# Altium project Main.PrjPCB
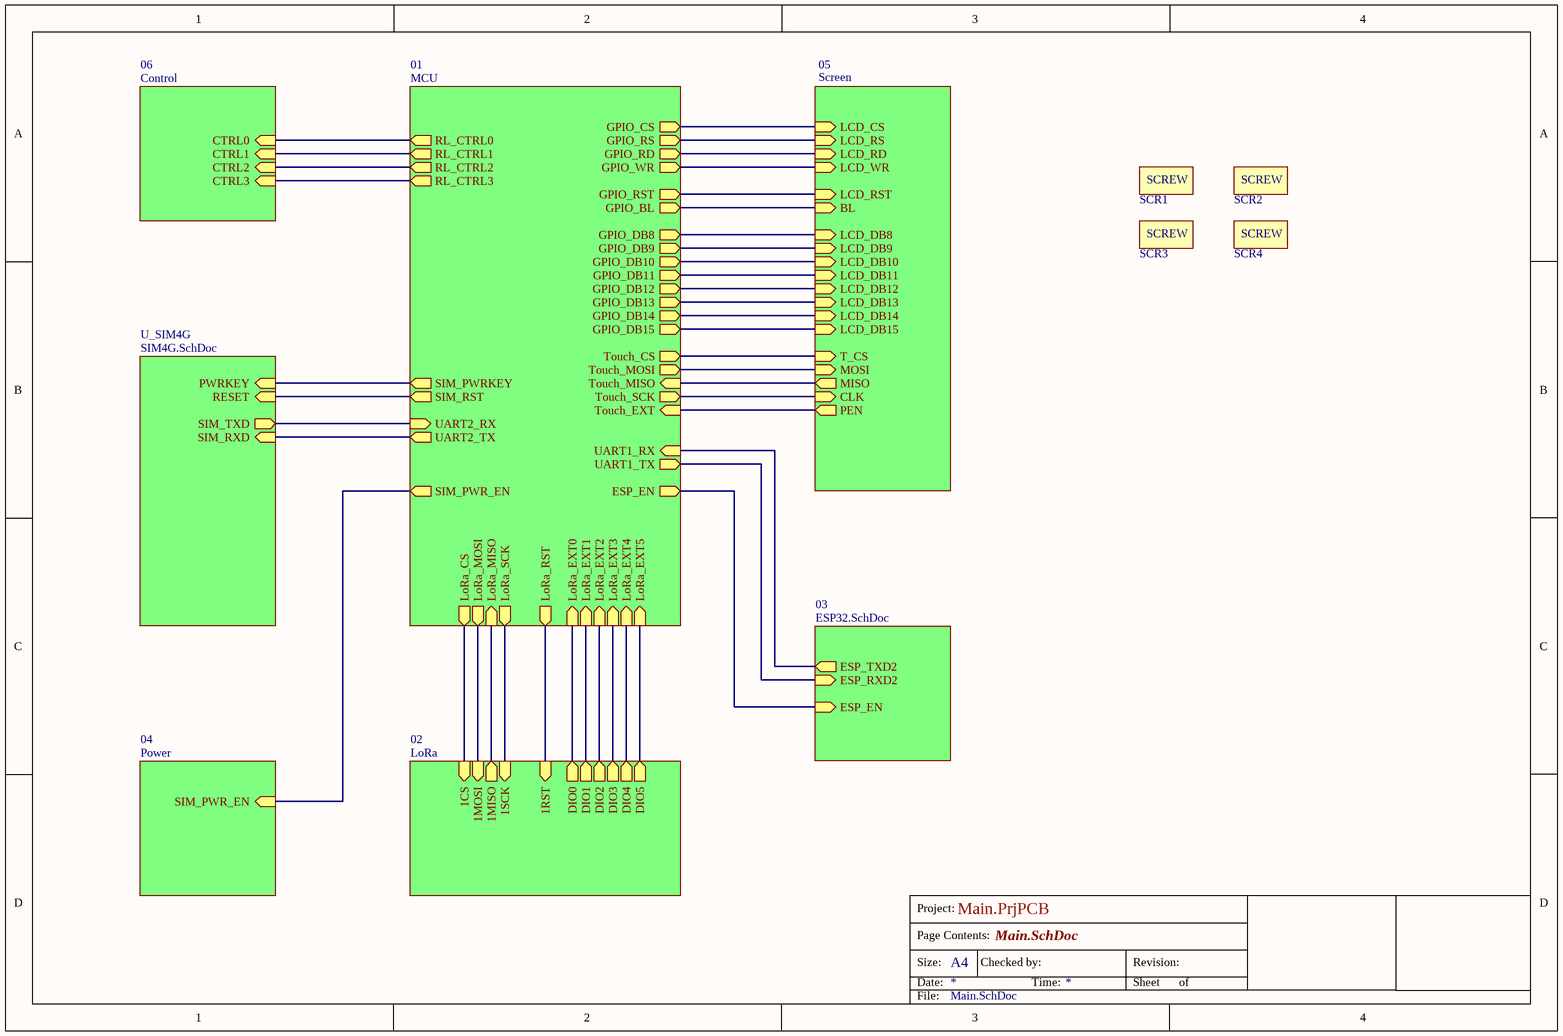
[diagram p0: Main.SchDoc]
8 sheets, 174 parts. Net scope: hierarchical (ports join the sheet entries above them; power ports are global).
Board file: Gateway_V2.PcbDoc
Sheets:
  Main.SchDoc
    01 = MCU.SchDoc
    02 = LoRa.SchDoc
    04 = Power.SchDoc
    05 = Screen.SchDoc
    03 = ESP32.SchDoc
    06 = Control.SchDoc
    U_SIM4G = SIM4G.SchDoc

## Sheet Main.SchDoc: =ProjectName
size A4; CheckedBy: DatNB; Author: Ven; CompanyName: Nacentech; Organization: IMET

### Parts
SCR1  Screw 3mm  [SCREW]  (value not drawn)
SCR2  Screw 3mm  [SCREW]  (value not drawn)
SCR3  Screw 3mm  [SCREW]  (value not drawn)
SCR4  Screw 3mm  [SCREW]  (value not drawn)

### Sub-sheets
01 = MCU: GPIO_WR (out), GPIO_RD (out), LoRa_RST (out), LoRa_CS (out), GPIO_BL (out), GPIO_CS (out), LoRa_MOSI (out), LoRa_SCK (out), LoRa_MISO (in), GPIO_RST (out), GPIO_RS (out), RL_CTRL3 (out), RL_CTRL0 (out), RL_CTRL1 (out), RL_CTRL2 (out), UART2_RX (in), UART2_TX (out), GPIO_DB10 (out), GPIO_DB13 (out), GPIO_DB12 (out), GPIO_DB14 (out), GPIO_DB8 (out), GPIO_DB15 (out), GPIO_DB11 (out), GPIO_DB9 (out), Touch_CS (out), Touch_SCK (out), Touch_MOSI (out), Touch_MISO (in), UART1_RX (in), LoRa_EXT4 (in), Touch_EXT (in), ESP_EN (out), LoRa_EXT0 (in), UART1_TX (out), LoRa_EXT2 (in), SIM_RST (out), LoRa_EXT5 (in), LoRa_EXT1 (in), SIM_PWR_EN (out), SIM_PWRKEY (out), LoRa_EXT3 (in)
02 = LoRa: 1MOSI (in), DIO5 (out), DIO3 (out), DIO4 (out), DIO2 (out), 1SCK (in), DIO1 (out), DIO0 (out), 1CS (in), 1MISO (out), 1RST (in)
03 = ESP32.SchDoc: ESP_TXD2 (out), ESP_RXD2 (in), ESP_EN (in)
04 = Power: SIM_PWR_EN (in)
05 = Screen: BL (in), LCD_RS (in), LCD_RD (in), LCD_WR (in), LCD_RST (in), LCD_CS (in), LCD_DB15 (in), LCD_DB12 (in), LCD_DB9 (in), LCD_DB13 (in), LCD_DB10 (in), LCD_DB8 (in), LCD_DB14 (in), LCD_DB11 (in), CLK (in), MISO (out), T_CS (in), PEN (out), MOSI (in)
06 = Control: CTRL0 (in), CTRL2 (in), CTRL1 (in), CTRL3 (in)
U_SIM4G = SIM4G.SchDoc: PWRKEY (in), RESET (in), SIM_TXD (out), SIM_RXD (in)

### Nets
NetC32_1: sheet 01/UART2_RX, sheet U_SIM4G/SIM_TXD
NetIC1_27: sheet 01/UART1_TX, sheet 03/ESP_RXD2
NetIC1_28: sheet 01/UART1_RX, sheet 03/ESP_TXD2
NetJ3_1: sheet 01/GPIO_CS, sheet 05/LCD_CS
NetJ3_2: sheet 01/GPIO_RS, sheet 05/LCD_RS
NetJ3_3: sheet 01/GPIO_WR, sheet 05/LCD_WR
NetJ3_4: sheet 01/GPIO_RD, sheet 05/LCD_RD
NetJ3_5: sheet 01/GPIO_RST, sheet 05/LCD_RST
NetJ3_14: sheet 01/GPIO_DB8, sheet 05/LCD_DB8
NetJ3_15: sheet 01/GPIO_DB9, sheet 05/LCD_DB9
NetJ3_16: sheet 01/GPIO_DB10, sheet 05/LCD_DB10
NetJ3_17: sheet 01/GPIO_DB11, sheet 05/LCD_DB11
NetJ3_18: sheet 01/GPIO_DB12, sheet 05/LCD_DB12
NetJ3_19: sheet 01/GPIO_DB13, sheet 05/LCD_DB13
NetJ3_20: sheet 01/GPIO_DB14, sheet 05/LCD_DB14
NetJ3_21: sheet 01/GPIO_DB15, sheet 05/LCD_DB15
NetJ3_23: sheet 01/GPIO_BL, sheet 05/BL
NetJ3_29: sheet 01/Touch_MISO, sheet 05/MISO
NetJ3_30: sheet 01/Touch_MOSI, sheet 05/MOSI
NetJ3_31: sheet 01/Touch_EXT, sheet 05/PEN
NetJ3_33: sheet 01/Touch_CS, sheet 05/T_CS
NetJ3_34: sheet 01/Touch_SCK, sheet 05/CLK
NetQ8_2: sheet 01/UART2_TX, sheet U_SIM4G/SIM_RXD
NetR4_2: sheet 01/ESP_EN, sheet 03/ESP_EN
NetR17_2: sheet 01/SIM_PWR_EN, sheet 04/SIM_PWR_EN
NetR22_1: sheet 01/RL_CTRL0, sheet 06/CTRL0
NetR23_1: sheet 01/RL_CTRL1, sheet 06/CTRL1
NetR28_1: sheet 01/RL_CTRL2, sheet 06/CTRL2
NetR29_1: sheet 01/RL_CTRL3, sheet 06/CTRL3
NetR38_2: sheet 01/SIM_PWRKEY, sheet U_SIM4G/PWRKEY
NetR39_2: sheet 01/SIM_RST, sheet U_SIM4G/RESET
NetU1_4: sheet 01/LoRa_RST, sheet 02/1RST
NetU1_5: sheet 01/LoRa_EXT0, sheet 02/DIO0
NetU1_6: sheet 01/LoRa_EXT1, sheet 02/DIO1
NetU1_7: sheet 01/LoRa_EXT2, sheet 02/DIO2
NetU1_8: sheet 01/LoRa_EXT3, sheet 02/DIO3
NetU1_10: sheet 01/LoRa_EXT4, sheet 02/DIO4
NetU1_11: sheet 01/LoRa_EXT5, sheet 02/DIO5
NetU1_12: sheet 01/LoRa_SCK, sheet 02/1SCK
NetU1_13: sheet 01/LoRa_MISO, sheet 02/1MISO
NetU1_14: sheet 01/LoRa_MOSI, sheet 02/1MOSI
NetU1_15: sheet 01/LoRa_CS, sheet 02/1CS

Not connected (* = marked no-connect by the designer): SCR1 0; SCR2 0; SCR3 0; SCR4 0

### Notes on the sheet
- Project:
- Page Contents:
- Size:
- Date:
- A4
- Checked by:
- Time:
- Revision:
- Sheet
- of
- File:
- (in symbol screw3m) SCREW

### Library data of the parts
SCR1-SCR4 = screw3m

## Sheet MCU.SchDoc: =ProjectName
size A4; CheckedBy: DatNB; Author: Ven; CompanyName: Nacentech; Organization: IMET
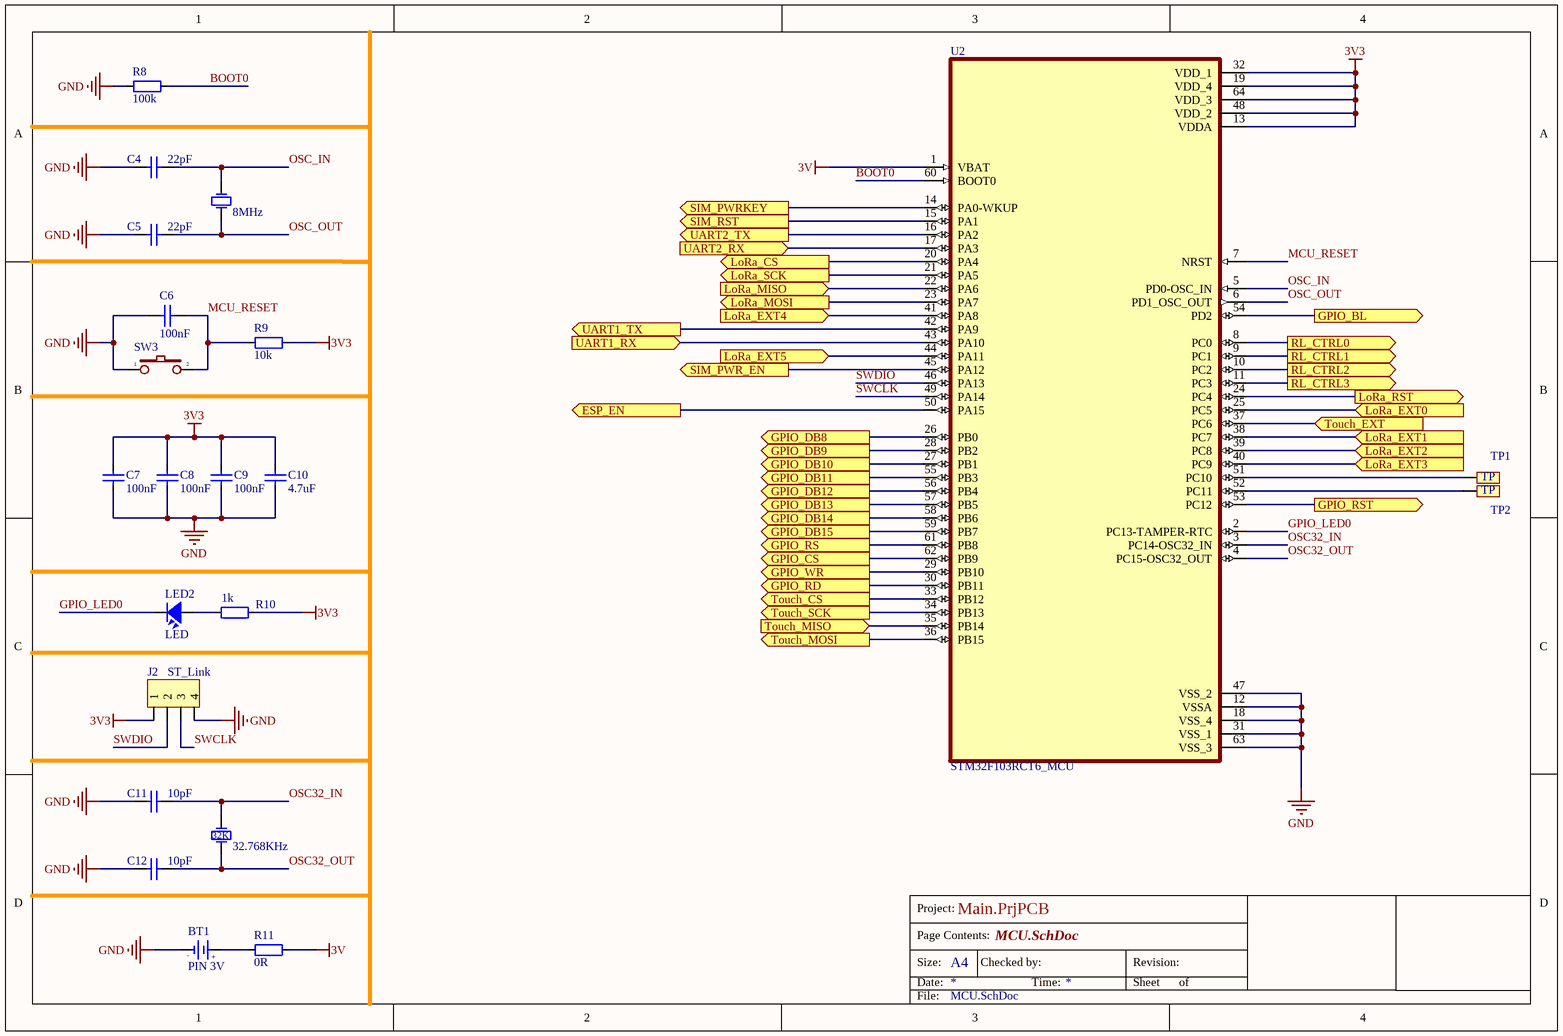
[diagram p1: MCU.SchDoc]

### Parts
BT1  PIN 3V  [CR1220 SMD]
C4  22pF  [CAP_0805]
C5  22pF  [CAP_0805]
C6  100nF  [CAP_0805]
C7  100nF  [CAP_0805]
C8  100nF  [CAP_0805]
C9  100nF  [CAP_0805]
C10  4.7uF  [CAP_0805]
C11  10pF  [CAP_0805]
C12  10pF  [CAP_0805]
J2  ST_Link  [Header4 - SMD 1.25mm - B]
LED2  LED  [LED-0805-Green]
R8  100k  [RES-SMD-0805]
R9  10k  [RES-SMD-0805]
R10  1k  [RES-SMD-0805]
R11  0R  [RES-SMD-0805]
SW3  SW  [SW 3x2x4]  (value not drawn)
TP1  (no value)  [TP_SMD]
TP2  (no value)  [TP_SMD]
U2  STM32F103RCT6_MCU  [LQFP 64]
Y1  8MHz  [XTAL]
Y2  32.768KHz  [XTAL32K]

### Ports
ESP_EN (out), GPIO_BL (out), GPIO_CS (out), GPIO_DB8 (out), GPIO_DB9 (out), GPIO_DB10 (out), GPIO_DB11 (out), GPIO_DB12 (out), GPIO_DB13 (out), GPIO_DB14 (out), GPIO_DB15 (out), GPIO_RD (out), GPIO_RS (out), GPIO_RST (out), GPIO_WR (out), LoRa_CS (out), LoRa_EXT0 (in), LoRa_EXT1 (in), LoRa_EXT2 (in), LoRa_EXT3 (in), LoRa_EXT4 (in), LoRa_EXT5 (in), LoRa_MISO (in), LoRa_MOSI (out), LoRa_RST (out), LoRa_SCK (out), RL_CTRL0 (out), RL_CTRL1 (out), RL_CTRL2 (out), RL_CTRL3 (out), SIM_PWR_EN (out), SIM_PWRKEY (out), SIM_RST (out), Touch_CS (out), Touch_EXT (in), Touch_MISO (in), Touch_MOSI (out), Touch_SCK (out), UART1_RX (in), UART1_TX (out), UART2_RX (in), UART2_TX (out)

### Nets
3V: R11.1 U2.1(VBAT)
3V3: C7.2 C8.2 C9.2 C10.2 J2.1 R9.1 R10.1 U2.13(VDDA) U2.19(VDD_4) U2.32(VDD_1) U2.48(VDD_2) U2.64(VDD_3)
GND: BT1.2(GND) C4.1 C5.1 C6.1 C7.1 C8.1 C9.1 C10.1 C11.1 C12.1 J2.4 R8.2 SW3.1 U2.12(VSSA) U2.18(VSS_4) U2.31(VSS_1) U2.47(VSS_2) U2.63(VSS_3)
BOOT0: R8.1 U2.60(BOOT0)
GPIO_LED0: LED2.2 U2.2(PC13-TAMPER-RTC)
MCU_RESET: C6.2 R9.2 SW3.2 U2.7(NRST)
OSC32_IN: C11.2 U2.3(PC14-OSC32_IN) Y2.1(OSC1)
OSC32_OUT: C12.2 U2.4(PC15-OSC32_OUT) Y2.2(OSC2)
OSC_IN: C4.2 U2.5(PD0-OSC_IN) Y1.1(OSC1)
OSC_OUT: C5.2 U2.6(PD1_OSC_OUT) Y1.2(OSC2)
SWCLK: J2.3 U2.49(PA14)
SWDIO: J2.2 U2.46(PA13)
NetBT1_1: BT1.1(+3V) R11.2
NetC32_1: U2.17(PA3) ; port UART2_RX
NetIC1_27: U2.42(PA9) ; port UART1_TX
NetIC1_28: U2.43(PA10) ; port UART1_RX
NetJ3_1: U2.62(PB9) ; port GPIO_CS
NetJ3_2: U2.61(PB8) ; port GPIO_RS
NetJ3_3: U2.29(PB10) ; port GPIO_WR
NetJ3_4: U2.30(PB11) ; port GPIO_RD
NetJ3_5: U2.53(PC12) ; port GPIO_RST
NetJ3_14: U2.26(PB0) ; port GPIO_DB8
NetJ3_15: U2.28(PB2) ; port GPIO_DB9
NetJ3_16: U2.27(PB1) ; port GPIO_DB10
NetJ3_17: U2.55(PB3) ; port GPIO_DB11
NetJ3_18: U2.56(PB4) ; port GPIO_DB12
NetJ3_19: U2.57(PB5) ; port GPIO_DB13
NetJ3_20: U2.58(PB6) ; port GPIO_DB14
NetJ3_21: U2.59(PB7) ; port GPIO_DB15
NetJ3_23: U2.54(PD2) ; port GPIO_BL
NetJ3_29: U2.35(PB14) ; port Touch_MISO
NetJ3_30: U2.36(PB15) ; port Touch_MOSI
NetJ3_31: U2.37(PC6) ; port Touch_EXT
NetJ3_33: U2.33(PB12) ; port Touch_CS
NetJ3_34: U2.34(PB13) ; port Touch_SCK
NetLED2_1: LED2.1 R10.2
NetQ8_2: U2.16(PA2) ; port UART2_TX
NetR4_2: U2.50(PA15) ; port ESP_EN
NetR17_2: U2.45(PA12) ; port SIM_PWR_EN
NetR22_1: U2.8(PC0) ; port RL_CTRL0
NetR23_1: U2.9(PC1) ; port RL_CTRL1
NetR28_1: U2.10(PC2) ; port RL_CTRL2
NetR29_1: U2.11(PC3) ; port RL_CTRL3
NetR38_2: U2.14(PA0-WKUP) ; port SIM_PWRKEY
NetR39_2: U2.15(PA1) ; port SIM_RST
NetTP1_1: TP1.1 U2.51(PC10)
NetTP2_1: TP2.1 U2.52(PC11)
NetU1_4: U2.24(PC4) ; port LoRa_RST
NetU1_5: U2.25(PC5) ; port LoRa_EXT0
NetU1_6: U2.38(PC7) ; port LoRa_EXT1
NetU1_7: U2.39(PC8) ; port LoRa_EXT2
NetU1_8: U2.40(PC9) ; port LoRa_EXT3
NetU1_10: U2.41(PA8) ; port LoRa_EXT4
NetU1_11: U2.44(PA11) ; port LoRa_EXT5
NetU1_12: U2.21(PA5) ; port LoRa_SCK
NetU1_13: U2.22(PA6) ; port LoRa_MISO
NetU1_14: U2.23(PA7) ; port LoRa_MOSI
NetU1_15: U2.20(PA4) ; port LoRa_CS

### Notes on the sheet
- Project:
- Page Contents:
- Size:
- Date:
- A4
- Checked by:
- Time:
- Revision:
- Sheet
- of
- File:
- (in symbol XTAL/32KHz) 32K

### Library data of the parts
BT1 = PIN 3V: Battery 3VDC; Value: PIN 3V
C4-C12 = CapSMD: Capacitor; Value: 33p; Published: 8-Jun-2000; LatestRevisionDate: 17-Jul-2002; LatestRevisionNote: Re-released for DXP Platform.; PackageReference: RAD-0.3; Publisher: Altium Limited
J2 = Header4: Header IDC, 4 x 1 Pin Vertical 2.54mm Pitch (Non-Boxed, Male); Manufacturer: W¨¹rth Elektronik eiSos GmbH; partNo: 613002143121; ComponentLink1 Description: Manufacturer; ComponentLink2 Description: Datasheet; NoPins: 02; Created Date: 29 March 2013; ComponentLink1URL: http://www.we-online.com; ComponentLink2URL: http://katalog.we-online.de/em/datasheet/6130xx143121.pdf; Created by: Karrer Zheng
LED2 = LED: LED Single colour Green and Red; Value: LED 3 ly Single Colour
R8-R11 = Resistor - SMD: Resistor; Manufacturer: Generic Components; Class: Passive; Published: 08/06/2000; Publisher: Altium Hobart Technology Centre
SW3 = SW2: Switch button 2 pin; Value: SW chip 2 pin
TP1 TP2 = TP: CONNECT 1
U2 = stm32f103rct6
Y1 = XTAL: Crystal Oscillator; Published: 8-Jun-2000; LatestRevisionDate: 17-Jul-2002; LatestRevisionNote: Re-released for DXP Platform.; PackageReference: R38; Publisher: Altium Limited
Y2 = XTAL/32KHz: Crystal Oscillator; Published: 8-Jun-2000; LatestRevisionDate: 17-Jul-2002; LatestRevisionNote: Re-released for DXP Platform.; PackageReference: R38; Publisher: Altium Limited

## Sheet LoRa.SchDoc: =ProjectName
size A4; CheckedBy: DatNB; Author: Ven; CompanyName: Nacentech; Organization: IMET
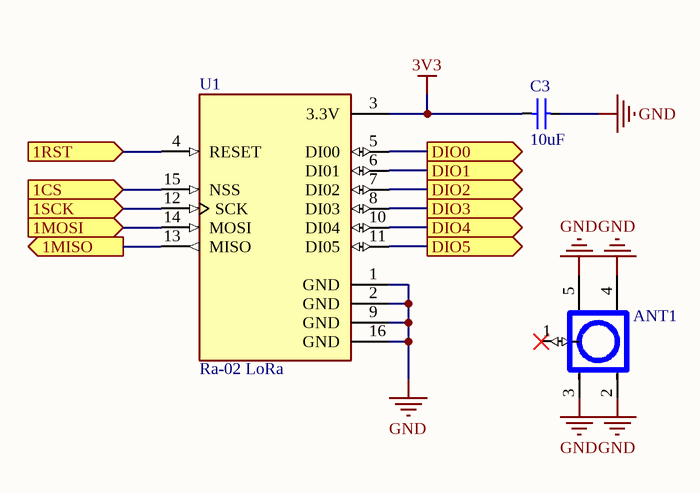
[diagram p2: LoRa.SchDoc]

### Parts
ANT1  anten  [SMA-RA]  (value not drawn)
C3  10uF  [CAP_0805]
U1  Ra-02 LoRa  [Ra-02]

### Ports
1CS (in), 1MISO (out), 1MOSI (in), 1RST (in), 1SCK (in), DIO0 (out), DIO1 (out), DIO2 (out), DIO3 (out), DIO4 (out), DIO5 (out)

### Nets
3V3: C3.2 U1.3(3.3V)
GND: ANT1.2 ANT1.3 ANT1.4 ANT1.5 C3.1 U1.1(GND) U1.2(GND) U1.9(GND) U1.16(GND)
NetU1_4: U1.4(RESET) ; port 1RST
NetU1_5: U1.5(DI00) ; port DIO0
NetU1_6: U1.6(DI01) ; port DIO1
NetU1_7: U1.7(DI02) ; port DIO2
NetU1_8: U1.8(DI03) ; port DIO3
NetU1_10: U1.10(DI04) ; port DIO4
NetU1_11: U1.11(DI05) ; port DIO5
NetU1_12: U1.12(SCK) ; port 1SCK
NetU1_13: U1.13(MISO) ; port 1MISO
NetU1_14: U1.14(MOSI) ; port 1MOSI
NetU1_15: U1.15(NSS) ; port 1CS

Not connected (* = marked no-connect by the designer): ANT1 1*

### Notes on the sheet
- Project:
- Page Contents:
- Size:
- Date:
- A4
- Checked by:
- Time:
- Revision:
- Sheet
- of
- File:

### Library data of the parts
ANT1 = anten: Anten 5 pins
C3 = CapSMD: Capacitor; Value: 33p; Published: 8-Jun-2000; LatestRevisionDate: 17-Jul-2002; LatestRevisionNote: Re-released for DXP Platform.; PackageReference: RAD-0.3; Publisher: Altium Limited
U1 = Ra-02 LoRa: LoRa Module Ra-02

## Sheet Power.SchDoc: =ProjectName
size A4; CheckedBy: DatNB; Author: Ven; CompanyName: Nacentech; Organization: IMET
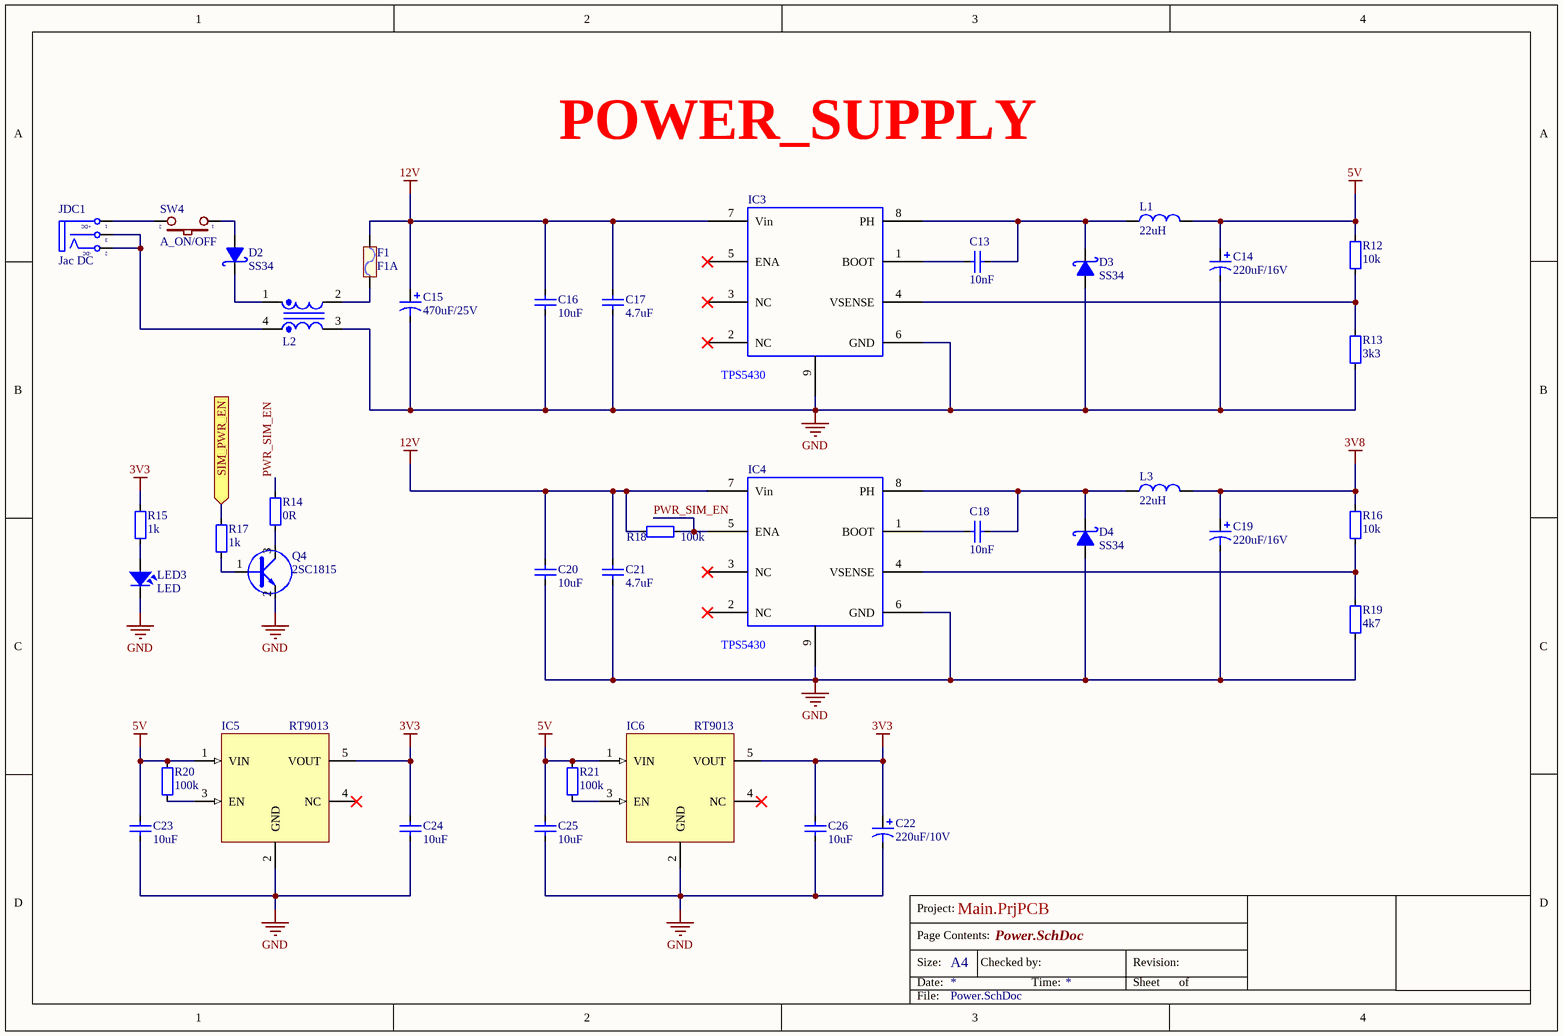
[diagram p3: Power.SchDoc]

### Parts
C13  10nF  [CAP_0805]
C14  220uF/16V  [C8mm]
C15  470uF/25V  [C8mm]
C16  10uF  [CAP_0805]
C17  4.7uF  [CAP_0805]
C18  10nF  [CAP_0805]
C19  220uF/16V  [C8mm]
C20  10uF  [CAP_0805]
C21  4.7uF  [CAP_0805]
C22  220uF/10V  [C8mm]
C23  10uF  [CAP_0805]
C24  10uF  [CAP_0805]
C25  10uF  [CAP_0805]
C26  10uF  [CAP_0805]
D2  SS34  [DO-214AC(SMA)]
D3  SS34  [DO-214AC(SMA)]
D4  SS34  [DO-214AC(SMA)]
F1  F1A  [FUSE2C]
IC3  TPS5430  [TPS5430-2]
IC4  TPS5430  [TPS5430-2]
IC5  RT9013  [SOT23-5]
IC6  RT9013  [SOT23-5]
JDC1  Jac DC  [DC-IN]
L1  22uH  [L-SMD-M-7.3x4.5]
L2  Inductor Filter  [EE8.3]  (value not drawn)
L3  22uH  [L-SMD-M-7.3x4.5]
LED3  LED  [LED-0805-Red]
Q4  2SC1815  [SOT23D]
R12  10k  [RES-SMD-0805]
R13  3k3  [RES-SMD-0805]
R14  0R  [RES-SMD-0805]
R15  1k  [RES-SMD-0805]
R16  10k  [RES-SMD-0805]
R17  1k  [RES-SMD-0805]
R18  100k  [RES-SMD-0805]
R19  4k7  [RES-SMD-0805]
R20  100k  [RES-SMD-0805]
R21  100k  [RES-SMD-0805]
SW4  A_ON/OFF  [SW102_SIDE]

### Ports
SIM_PWR_EN (in)

### Nets
3V3: C22.1 C24.2 C26.2 IC5.5(VOUT) IC6.5(VOUT) R15.2
3V8: C19.1 L3.2 R16.2
5V: C14.1 C23.2 C25.2 IC5.1(VIN) IC6.1(VIN) L1.2 R12.2 R20.1 R21.1
12V: C15.1 C16.2 C17.2 C20.2 C21.2 F1.2 IC3.7(Vin) IC4.7(Vin) R18.2
GND: C14.2 C15.2 C16.1 C17.1 C19.2 C20.1 C21.1 C22.2 C23.1 C24.1 C25.1 C26.1 D3.1(A) D4.1(A) IC3.6(GND) IC3.9(PWR_PAD) IC4.6(GND) IC4.9(PWR_PAD) IC5.2(GND) IC6.2(GND) L2.3 LED3.2 Q4.2(E) R13.1 R19.1
PWR_SIM_EN: IC4.5(ENA) R14.2 R18.1
NetC13_1: C13.1 D3.2(K) IC3.8(PH) L1.1
NetC13_2: C13.2 IC3.1(BOOT)
NetC18_1: C18.1 D4.2(K) IC4.8(PH) L3.1
NetC18_2: C18.2 IC4.1(BOOT)
NetD2_1: D2.1(A) SW4.1
NetD2_2: D2.2(K) L2.1
NetF1_1: F1.1 L2.2
NetIC3_4: IC3.4(VSENSE) R12.1 R13.2
NetIC4_4: IC4.4(VSENSE) R16.1 R19.2
NetIC5_3: IC5.3(EN) R20.2
NetIC6_3: IC6.3(EN) R21.2
NetJDC1_1: JDC1.1(T) SW4.2
NetJDC1_2: JDC1.2(TN) JDC1.3(S) L2.4
NetLED3_1: LED3.1 R15.1
NetQ4_1: Q4.1(B) R17.1
NetQ4_3: Q4.3(C) R14.1
NetR17_2: R17.2 ; port SIM_PWR_EN

Not connected (* = marked no-connect by the designer): IC3 2(NC)* 3(NC)* 5(ENA)*; IC4 2(NC)* 3(NC)*; IC5 4(NC)*; IC6 4(NC)*

### Notes on the sheet
- POWER_SUPPLY
- Project:
- Page Contents:
- Size:
- Date:
- A4
- Checked by:
- Time:
- Revision:
- Sheet
- of
- File:
- (in symbol DCIN) +DC; -DC

### Library data of the parts
C13 C16-C18 C20 C21 C23-C26 = CapSMD: Capacitor; Value: 33p; Published: 8-Jun-2000; LatestRevisionDate: 17-Jul-2002; LatestRevisionNote: Re-released for DXP Platform.; PackageReference: RAD-0.3; Publisher: Altium Limited
C14 C15 C19 C22 = Cap Pol: Polarized Capacitor (Axial); Published: 8-Jun-2000; LatestRevisionDate: 17-Jul-2002; LatestRevisionNote: Re-released for DXP Platform.; PackageReference: POLAR0.8; Publisher: Altium Limited
D2-D4 = Diode Schottky: Diode Schottky SS34
F1 = Fuse: Fuse RUEF300 30V 3A; Designed by: VanDungEvn; Value: Fuse
IC5 IC6 = RT9013: RT9013-33GB IC REG LINEAR 3.3V 500mA SOT23-5
JDC1 = DCIN: Jac DC input; Value: Jac DC
L1 L3 = Inductor: Value: 150 mH
L2 = L_Filter: Value: Loc 220; Designed by: VanDungEvn
LED3 = LED: as LED2 on sheet MCU
Q4 = C1815: NPN 600mW, ECB; Value: C1815
R12-R21 = Resistor - SMD: as R8 on sheet MCU; Published: 08/06/2000; Publisher: Altium Hobart Technology Centre
SW4 = SW2: as SW3 on sheet MCU
IC3 IC4 = TPS5430: Name: TPS5430

## Sheet Screen.SchDoc: =ProjectName
size A4; CheckedBy: DatNB; Author: Ven; CompanyName: Nacentech; Organization: IMET
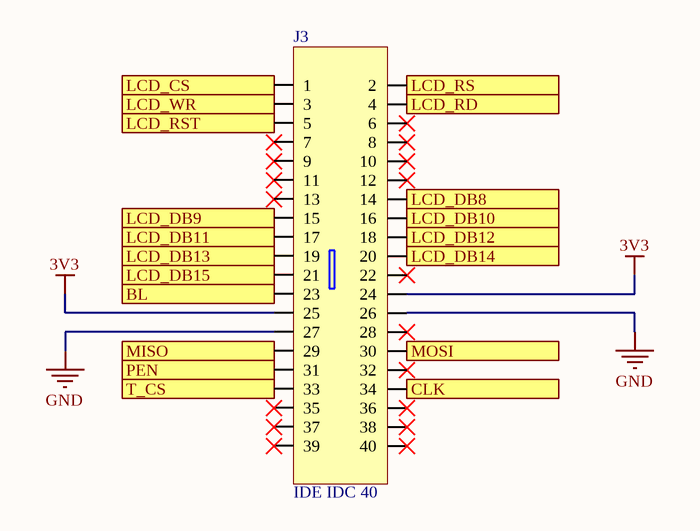
[diagram p4: Screen.SchDoc]

### Parts
J3  IDE IDC 40  [IDE 20X2]

### Ports
BL (in), CLK (in), LCD_CS (in), LCD_DB8 (in), LCD_DB9 (in), LCD_DB10 (in), LCD_DB11 (in), LCD_DB12 (in), LCD_DB13 (in), LCD_DB14 (in), LCD_DB15 (in), LCD_RD (in), LCD_RS (in), LCD_RST (in), LCD_WR (in), MISO (out), MOSI (in), PEN (out), T_CS (in)

### Nets
3V3: J3.24 J3.25
GND: J3.26 J3.27
NetJ3_1: J3.1 ; port LCD_CS
NetJ3_2: J3.2 ; port LCD_RS
NetJ3_3: J3.3 ; port LCD_WR
NetJ3_4: J3.4 ; port LCD_RD
NetJ3_5: J3.5 ; port LCD_RST
NetJ3_14: J3.14 ; port LCD_DB8
NetJ3_15: J3.15 ; port LCD_DB9
NetJ3_16: J3.16 ; port LCD_DB10
NetJ3_17: J3.17 ; port LCD_DB11
NetJ3_18: J3.18 ; port LCD_DB12
NetJ3_19: J3.19 ; port LCD_DB13
NetJ3_20: J3.20 ; port LCD_DB14
NetJ3_21: J3.21 ; port LCD_DB15
NetJ3_23: J3.23 ; port BL
NetJ3_29: J3.29 ; port MISO
NetJ3_30: J3.30 ; port MOSI
NetJ3_31: J3.31 ; port PEN
NetJ3_33: J3.33 ; port T_CS
NetJ3_34: J3.34 ; port CLK

Not connected (* = marked no-connect by the designer): J3 6* 7* 8* 9* 10* 11* 12* 13* 22* 28* 32* 35* 36* 37* 38* 39* 40*

### Notes on the sheet
- Project:
- Page Contents:
- Size:
- Date:
- A4
- Checked by:
- Time:
- Revision:
- Sheet
- of
- File:

### Library data of the parts
J3 = IDC 20X2

## Sheet ESP32.SchDoc: =ProjectName
size A4; CheckedBy: DatNB; Author: Ven; CompanyName: Nacentech; Organization: IMET
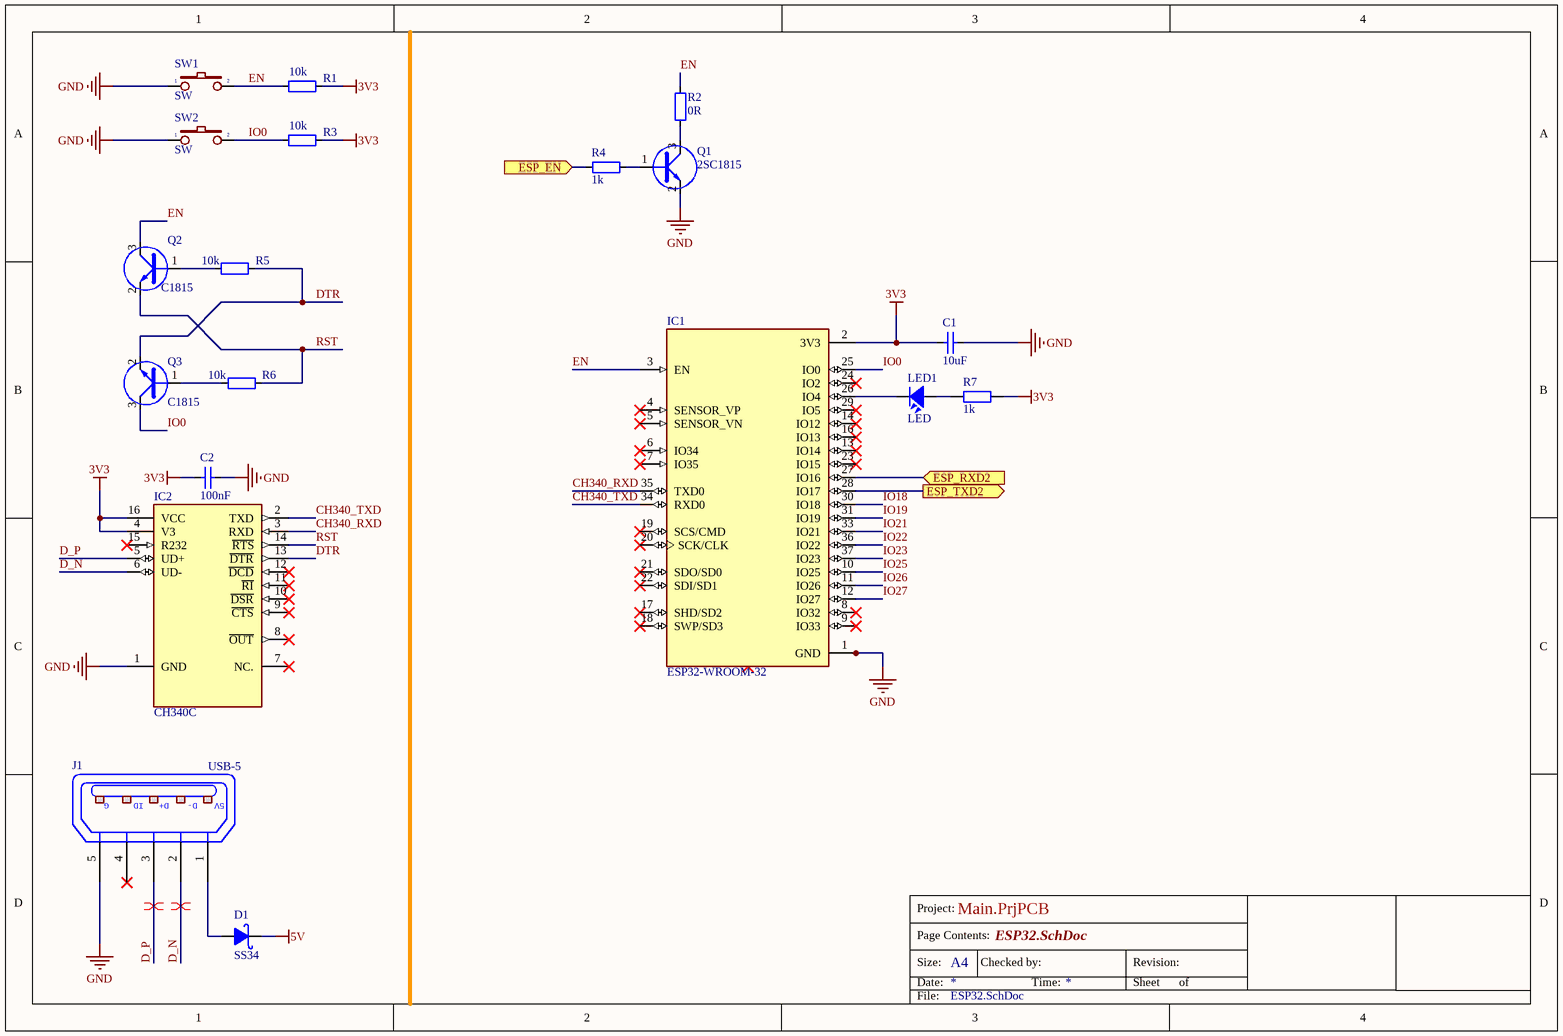
[diagram p5: ESP32.SchDoc]

### Parts
C1  10uF  [CAP_0805]
C2  100nF  [CAP_0805]
D1  SS34  [DO-214AC(SMA)]
IC1  ESP32-WROOM-32  [MODULE_ESP32-WROOM-32]
IC2  CH340C  [SO16]
J1  USB-5  [USB-M4]
LED1  LED  [LED-0805-Blue]
Q1  2SC1815  [SOT23D]
Q2  C1815  [SOT23D]
Q3  C1815  [SOT23D]
R1  10k  [RES-SMD-0805]
R2  0R  [RES-SMD-0805]
R3  10k  [RES-SMD-0805]
R4  1k  [RES-SMD-0805]
R5  10k  [RES-SMD-0805]
R6  10k  [RES-SMD-0805]
R7  1k  [RES-SMD-0805]
SW1  SW  [SW 3x2x4]
SW2  SW  [SW 3x2x4]

### Ports
ESP_EN (in), ESP_RXD2 (in), ESP_TXD2 (out)

### Nets
3V3: C1.1 C2.1 IC1.2(3V3) IC2.4(V3) IC2.16(VCC) R1.1 R3.1 R7.1
5V: D1.2(K)
GND: C1.2 C2.2 IC1.1(GND) IC1.15(GND) IC1.38(GND) IC1.39_1(GND) IC1.39_2(GND) IC1.39_3(GND) IC1.39_4(GND) IC1.39_5(GND) IC1.39_6(GND) IC1.39_7(GND) IC1.39_8(GND) IC1.39_9(GND) IC1.39_10(GND) IC1.39_11(GND) IC1.39_12(GND) IC1.39_13(GND) IC1.39_14(GND) IC1.39_15(GND) IC1.39_16(GND) IC1.39_17(GND) IC1.39_18(GND) IC1.39_19(GND) IC1.39_20(GND) IC1.39_21(GND) IC2.1(GND) J1.5(P5) Q1.2(E) SW1.1 SW2.1
CH340_RXD: IC1.35(TXD0) IC2.3(RXD)
CH340_TXD: IC1.34(RXD0) IC2.2(TXD)
D_N: IC2.6(UD-) J1.2(P2)
D_P: IC2.5(UD+) J1.3(P3)
DTR: IC2.13(~{DTR}) Q3.2(E) R5.1
EN: IC1.3(EN) Q2.3(C) R1.2 R2.2 SW1.2
IO0: IC1.25(IO0) Q3.3(C) R3.2 SW2.2
IO18: IC1.30(IO18)
IO19: IC1.31(IO19)
IO21: IC1.33(IO21)
IO22: IC1.36(IO22)
IO23: IC1.37(IO23)
IO25: IC1.10(IO25)
IO26: IC1.11(IO26)
IO27: IC1.12(IO27)
RST: IC2.14(~{RTS}) Q2.2(E) R6.1
NetD1_1: D1.1(A) J1.1(P1)
NetIC1_26: IC1.26(IO4) LED1.2
NetIC1_27: IC1.27(IO16) ; port ESP_RXD2
NetIC1_28: IC1.28(IO17) ; port ESP_TXD2
NetLED1_1: LED1.1 R7.2
NetQ1_1: Q1.1(B) R4.1
NetQ1_3: Q1.3(C) R2.1
NetQ2_1: Q2.1(B) R5.2
NetQ3_1: Q3.1(B) R6.2
NetR4_2: R4.2 ; port ESP_EN

Not connected (* = marked no-connect by the designer): IC1 4(SENSOR_VP)* 5(SENSOR_VN)* 6(IO34)* 7(IO35)* 8(IO32)* 9(IO33)* 13(IO14)* 14(IO12)* 16(IO13)* 17(SHD/SD2)* 18(SWP/SD3)* 19(SCS/CMD)* 20(SCK/CLK)* 21(SDO/SD0)* 22(SDI/SD1)* 23(IO15)* 24(IO2)* 29(IO5)*; IC2 7(NC.)* 8(~{OUT})* 9(~{CTS})* 10(~{DSR})* 11(~{RI})* 12(~{DCD})* 15(R232)*; J1 4(P4)*

### Layout directives
differential pair: D_N, D_P

### Notes on the sheet
- Project:
- Page Contents:
- Size:
- Date:
- A4
- Checked by:
- Time:
- Revision:
- Sheet
- of
- File:
- (in symbol USB-5) G; ID; D+; D-; 5V

### Library data of the parts
C1 C2 = CapSMD: Capacitor; Value: 33p; Published: 8-Jun-2000; LatestRevisionDate: 17-Jul-2002; LatestRevisionNote: Re-released for DXP Platform.; PackageReference: RAD-0.3; Publisher: Altium Limited
D1 = Diode Schottky: Diode Schottky SS34
IC1 = ESP32-WROOM-32: Bluetooth, WiFi Transceiver Module 2.4GHz ~ 2.5GHz Surface Mount; MF: Espressif Systems; Package: Module Espressif Systems; Digi-Key_Part_Number: 1904-1010-1-ND; Digi-Key_Purchase_URL: https://www.digikey.com/product-detail/en/espressif-systems/ESP32-WROOM-32/1904-1010-1-ND/8544305?utm_source=snapeda&utm_medium=aggregator&utm_campaign=symbol; Value: *; MP: ESP32-WROOM-32; SnapEDA_Link: https://www.snapeda.com/parts/ESP32-WROOM-32/Espressif%20Systems/view-part/2753322/?ref=snap
J1 = USB-5: Manufacturer: FCI; Manufacturer Part Number: 10118193-0001LF; Connector Type: USB - micro B; Number of Contacts: 5; Gender: Receptacle; Specifications: USB 2.0; .Creator: MM; .Checked PCB: RF; Supplier 1: Digi-Key; RoHS: RoHS Compliant; Category: Connectors, Interconnects; Stock 1: 28642; Pricing 1: 1=0.46, 10=0.433, 25=0.3712, 50=0.3156, 100=0.3032, 250=0.27224, 500=0.25988 (USD); Packaging: Cut Tape (CT); Mounting Type: Surface Mount, Right Angle, Horizontal; Features: Shielded, Solder Retention; Ingress Protection: -; ComponentLink1URL: http://portal.fciconnect.com/Comergent//fci/drawing/10118193.pdf; ComponentLink1Description: http://portal.fciconnect.com/Comergent//fci/drawing/10118193.pdf; Supplier Part Number 1: 609-4616-1-ND; .Checked SCH: MM
LED1 = LED: as LED2 on sheet MCU
Q1 = C1815: NPN 600mW, ECB; Value: C1815
Q2 Q3 = 2SC1815: NPN 600mW, ECB; Value: C1815
R1-R6 = Resistor - SMD: as R8 on sheet MCU; Published: 08/06/2000; Publisher: Altium Hobart Technology Centre
R7 = Resistor - SMD: Resistor SMD; Manufacturer: Generic Components; Class: Passive; Published: 08/06/2000; Publisher: Altium Hobart Technology Centre
SW1 SW2 = SW2: as SW3 on sheet MCU

## Sheet Control.SchDoc: =ProjectName
size A4; CheckedBy: DatNB; Author: Ven; CompanyName: Nacentech; Organization: IMET
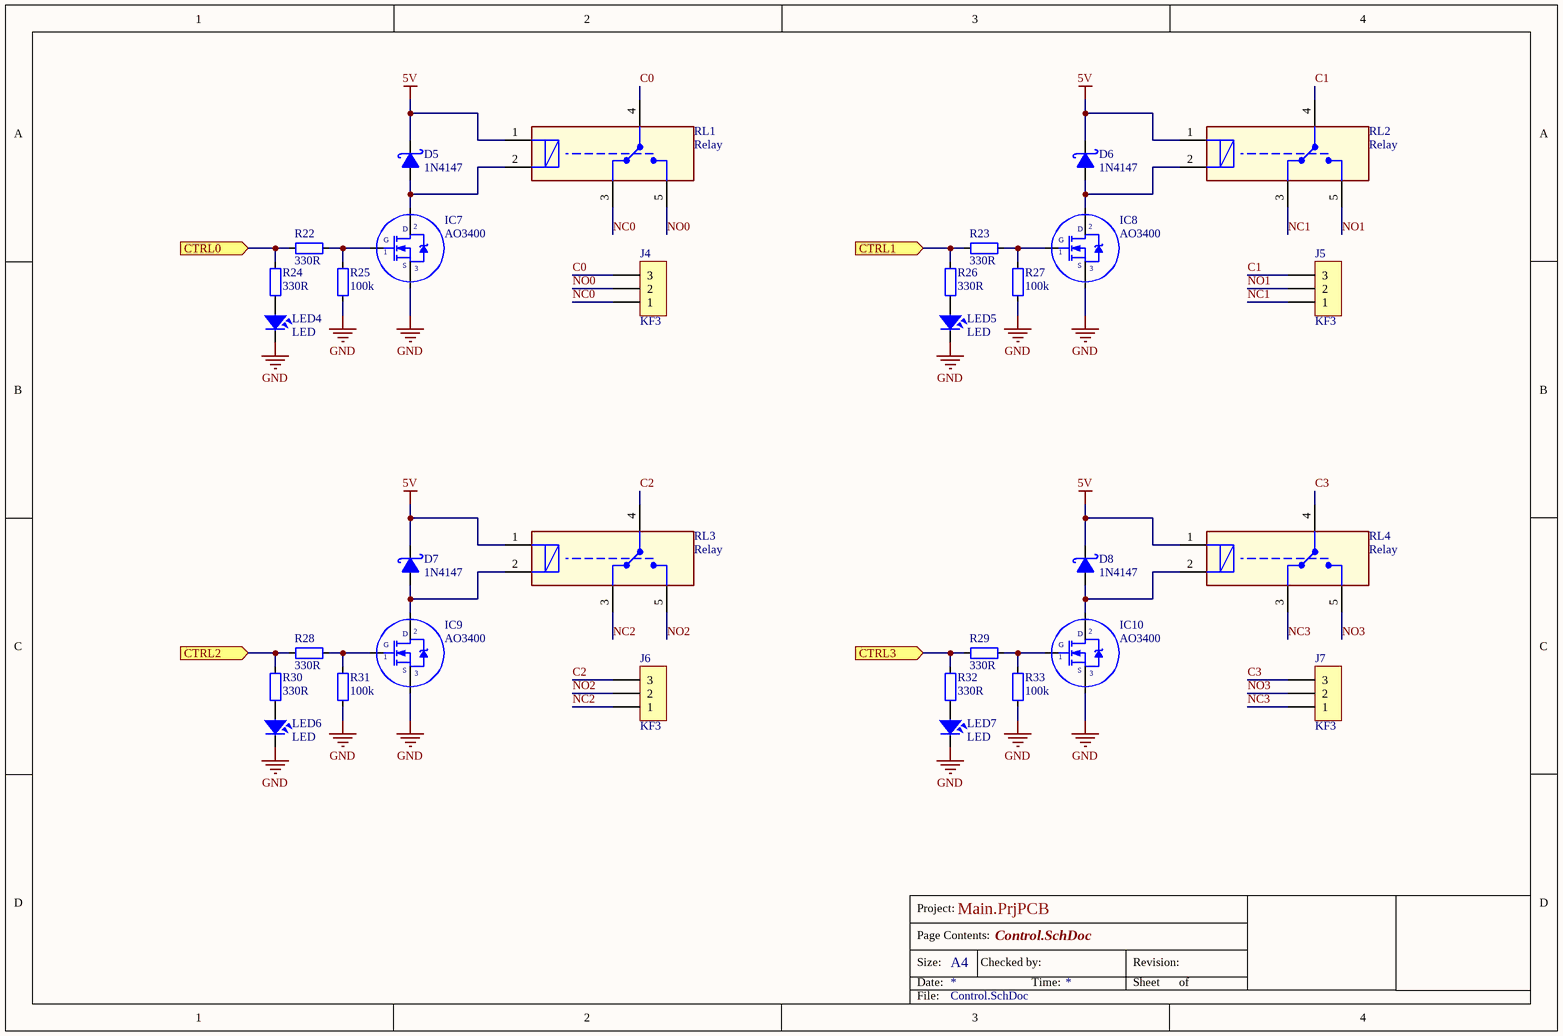
[diagram p6: Control.SchDoc]

### Parts
D5  1N4147  [DIO_R_SMD]
D6  1N4147  [DIO_R_SMD]
D7  1N4147  [DIO_R_SMD]
D8  1N4147  [DIO_R_SMD]
IC7  AO3400  [SOT23A]
IC8  AO3400  [SOT23A]
IC9  AO3400  [SOT23A]
IC10  AO3400  [SOT23A]
J4  KF3  [KF3-3.5-EDG]
J5  KF3  [KF3-3.5-EDG]
J6  KF3  [KF3-3.5-EDG]
J7  KF3  [KF3-3.5-EDG]
LED4  LED  [LED-0805-Red]
LED5  LED  [LED-0805-Red]
LED6  LED  [LED-0805-Red]
LED7  LED  [LED-0805-Red]
R22  330R  [RES-SMD-0805]
R23  330R  [RES-SMD-0805]
R24  330R  [RES-SMD-0805]
R25  100k  [RES-SMD-0805]
R26  330R  [RES-SMD-0805]
R27  100k  [RES-SMD-0805]
R28  330R  [RES-SMD-0805]
R29  330R  [RES-SMD-0805]
R30  330R  [RES-SMD-0805]
R31  100k  [RES-SMD-0805]
R32  330R  [RES-SMD-0805]
R33  100k  [RES-SMD-0805]
RL1  Relay  [HF115F-XXX-1Z]
RL2  Relay  [HF115F-XXX-1Z]
RL3  Relay  [HF115F-XXX-1Z]
RL4  Relay  [HF115F-XXX-1Z]

### Ports
CTRL0 (in), CTRL1 (in), CTRL2 (in), CTRL3 (in)

### Nets
5V: D5.2(K) D6.2(K) D7.2(K) D8.2(K) RL1.1(+) RL2.1(+) RL3.1(+) RL4.1(+)
GND: IC7.3(S) IC8.3(S) IC9.3(S) IC10.3(S) LED4.2 LED5.2 LED6.2 LED7.2 R25.1 R27.1 R31.1 R33.1
C0: J4.3 RL1.4(C)
C1: J5.3 RL2.4(C)
C2: J6.3 RL3.4(C)
C3: J7.3 RL4.4(C)
NC0: J4.1 RL1.3(NC)
NC1: J5.1 RL2.3(NC)
NC2: J6.1 RL3.3(NC)
NC3: J7.1 RL4.3(NC)
NO0: J4.2 RL1.5(NO)
NO1: J5.2 RL2.5(NO)
NO2: J6.2 RL3.5(NO)
NO3: J7.2 RL4.5(NO)
NetD5_1: D5.1(A) IC7.2(D) RL1.2(-)
NetD6_1: D6.1(A) IC8.2(D) RL2.2(-)
NetD7_1: D7.1(A) IC9.2(D) RL3.2(-)
NetD8_1: D8.1(A) IC10.2(D) RL4.2(-)
NetIC7_1: IC7.1(G) R22.2 R25.2
NetIC8_1: IC8.1(G) R23.2 R27.2
NetIC9_1: IC9.1(G) R28.2 R31.2
NetIC10_1: IC10.1(G) R29.2 R33.2
NetLED4_1: LED4.1 R24.2
NetLED5_1: LED5.1 R26.2
NetLED6_1: LED6.1 R30.2
NetLED7_1: LED7.1 R32.2
NetR22_1: R22.1 R24.1 ; port CTRL0
NetR23_1: R23.1 R26.1 ; port CTRL1
NetR28_1: R28.1 R30.1 ; port CTRL2
NetR29_1: R29.1 R32.1 ; port CTRL3

### Notes on the sheet
- Project:
- Page Contents:
- Size:
- Date:
- A4
- Checked by:
- Time:
- Revision:
- Sheet
- of
- File:

### Library data of the parts
D5-D8 = Diode Schottky: Generic Diode Schottky
IC7-IC10 = MOSFET_N: Generic N Channel MOSFET
J4-J7 = KF3: Manufacturer: Würth Elektronik eiSos GmbH; partNo: 691103110003; ComponentLink1 Description: Manufacturer; ComponentLink2 Description: Datasheet; NoPins: 3; Created Date: 29 October 2013; ComponentLink1URL: http://www.we-online.com; ComponentLink2URL: http://katalog.we-online.de/em/datasheet/6911031100xx.pdf; Created by: Karrer Zheng
LED4-LED7 = LED: as LED2 on sheet MCU
R22-R33 = Resistor - SMD: as R8 on sheet MCU; Published: 08/06/2000; Publisher: Altium Hobart Technology Centre
RL1-RL4 = Relay_HF: Relay 12V, 220VAC/5A, 4 pins

## Sheet SIM4G.SchDoc: =ProjectName
size A3; Author: Ven
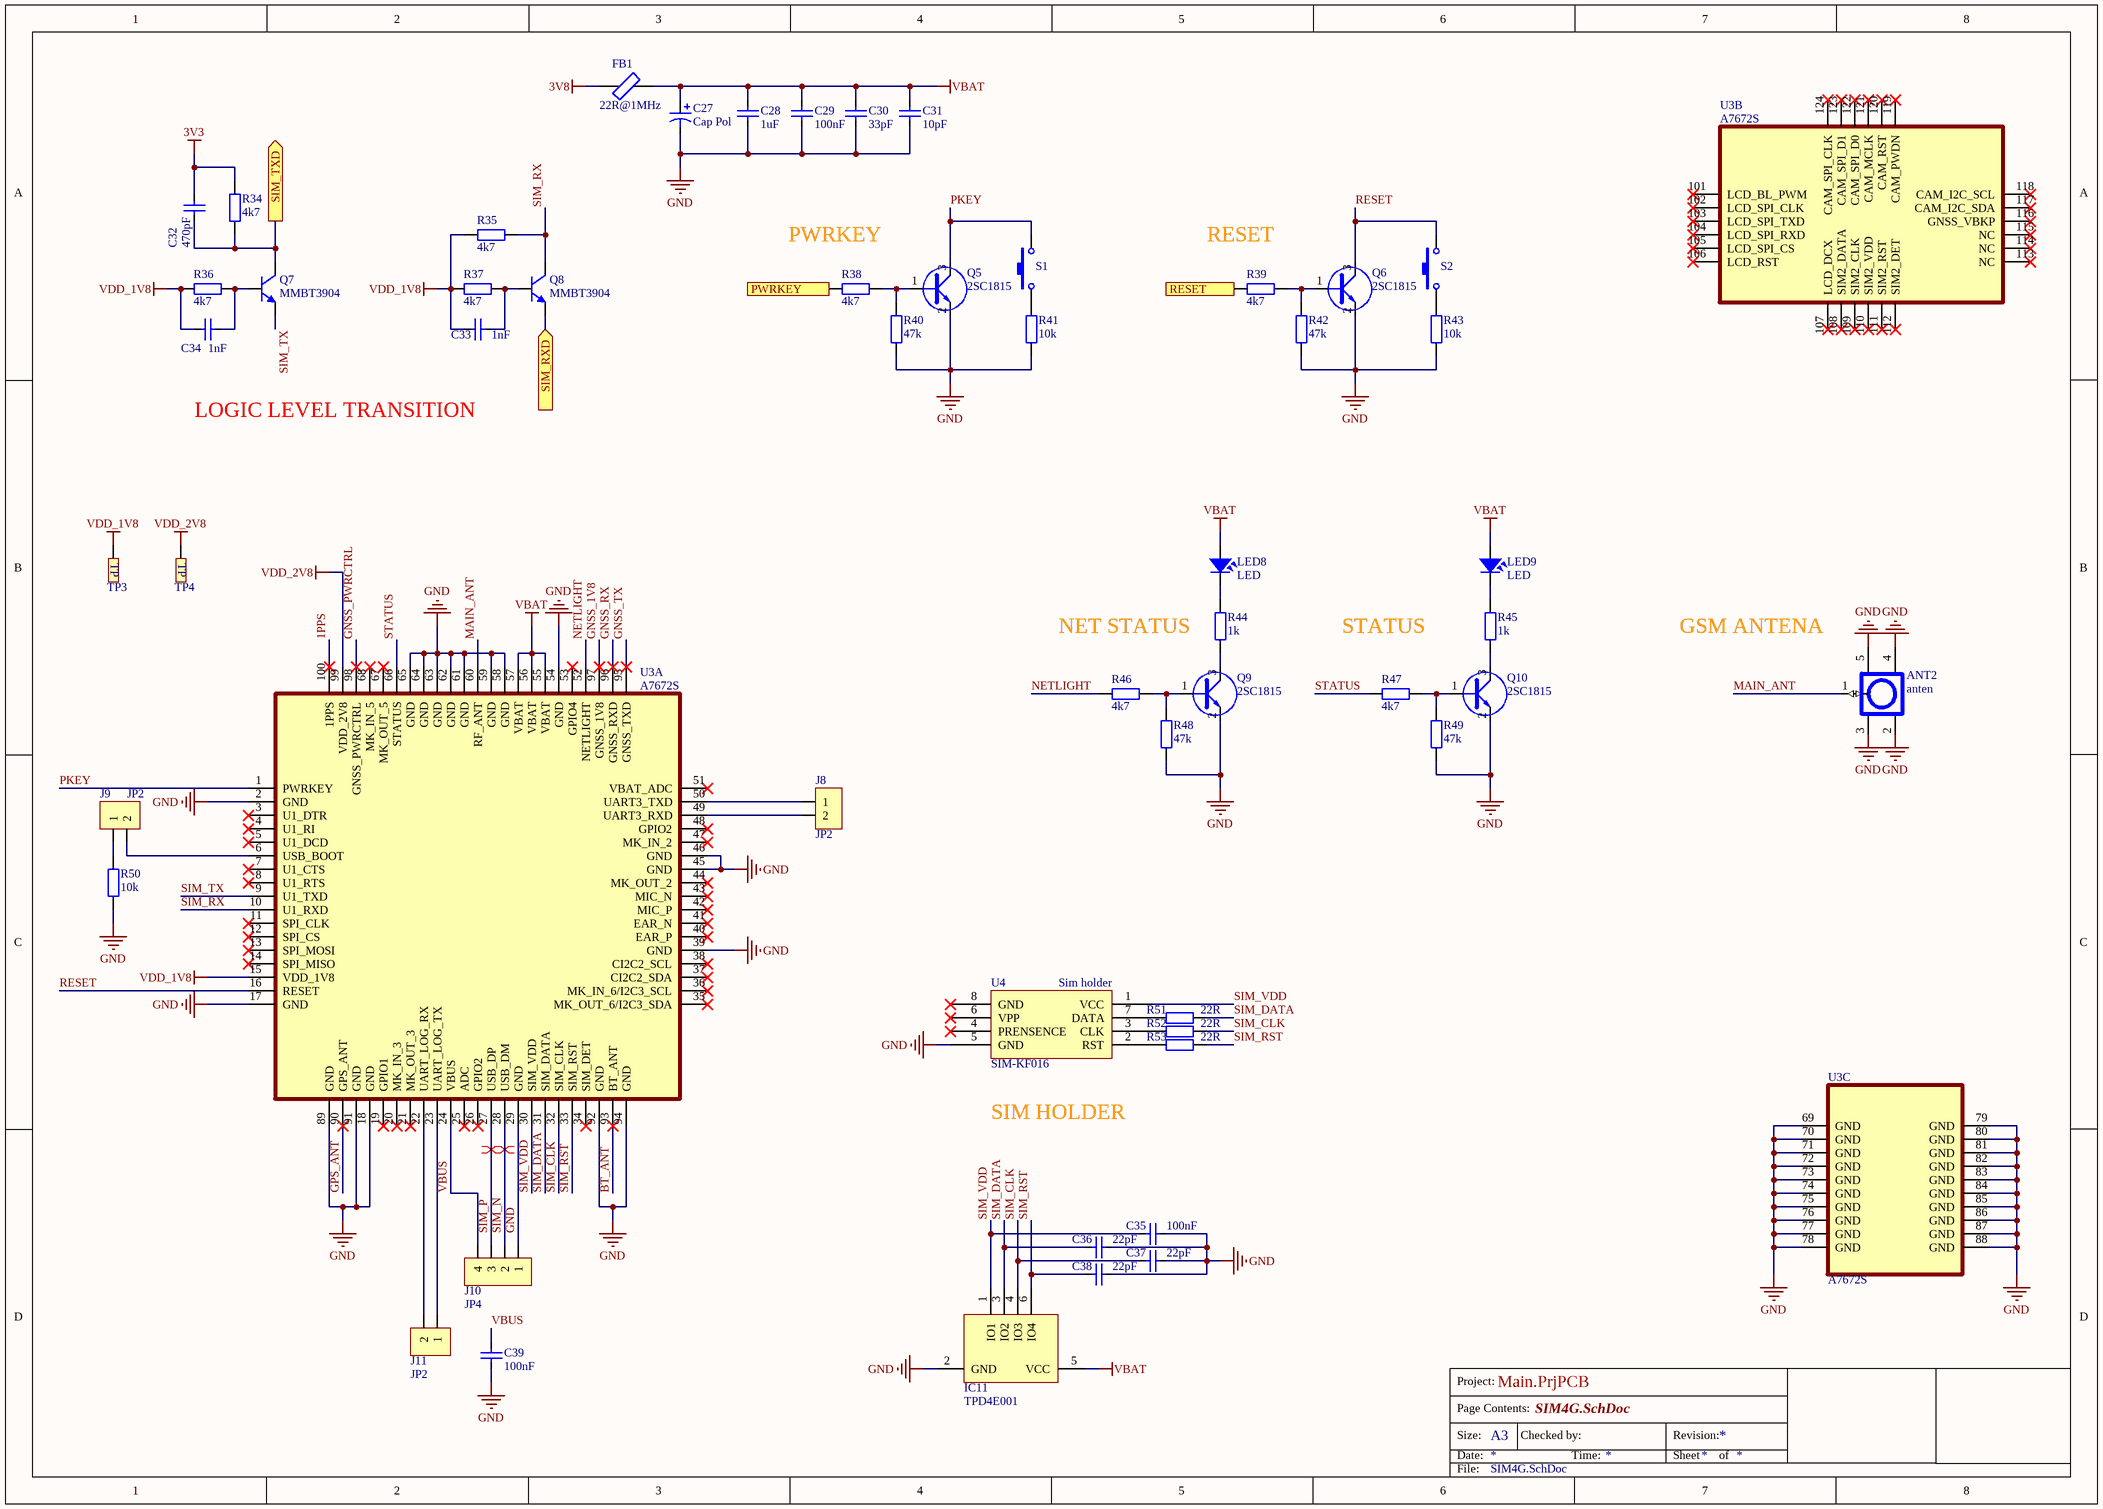
[diagram p7: SIM4G.SchDoc]

### Parts
ANT2  anten  [SMA-RA]
C27  Cap Pol  [CAP_7343]
C28  1uF  [CAP_0805]
C29  100nF  [CAP_0805]
C30  33pF  [CAP_0805]
C31  10pF  [CAP_0805]
C32  470pF  [CAP_0805]
C33  1nF  [CAP_0805]
C34  1nF  [CAP_0805]
C35  100nF  [CAP_0805]
C36  22pF  [CAP_0805]
C37  22pF  [CAP_0805]
C38  22pF  [CAP_0805]
C39  100nF  [CAP_0805]
FB1  22R@1MHz  [RES-SMD-0805]
IC11  TPD4E001  [SOT23-6]
J8  JP2  [JP2-C1T]
J9  JP2  [JP2-CLOSED]
J10  JP4  [Header4 - SMD 1.25mm - B]
J11  JP2  [JP2-C1T]
LED8  LED  [LED-0805-Orange]
LED9  LED  [LED-0805-Orange]
Q5  2SC1815  [SOT23D]
Q6  2SC1815  [SOT23D]
Q7  MMBT3904  [MMBT3904]
Q8  MMBT3904  [MMBT3904]
Q9  2SC1815  [SOT23D]
Q10  2SC1815  [SOT23D]
R34  4k7  [RES-SMD-0805]
R35  4k7  [RES-SMD-0805]
R36  4k7  [RES-SMD-0805]
R37  4k7  [RES-SMD-0805]
R38  4k7  [RES-SMD-0805]
R39  4k7  [RES-SMD-0805]
R40  47k  [RES-SMD-0805]
R41  10k  [RES-SMD-0805]
R42  47k  [RES-SMD-0805]
R43  10k  [RES-SMD-0805]
R44  1k  [RES-SMD-0805]
R45  1k  [RES-SMD-0805]
R46  4k7  [RES-SMD-0805]
R47  4k7  [RES-SMD-0805]
R48  47k  [RES-SMD-0805]
R49  47k  [RES-SMD-0805]
R50  10k  [RES-SMD-0805]
R51  22R  [RES-SMD-0805]
R52  22R  [RES-SMD-0805]
R53  22R  [RES-SMD-0805]
S1  SW-SMD  [SW 3x2x4]  (value not drawn)
S2  SW-SMD  [SW 3x2x4]  (value not drawn)
TP3  TEST POINT  [TP_SMD]  (value not drawn)
TP4  TEST POINT  [TP_SMD]  (value not drawn)
U3  A7672S  [A7672S]  (parts A,B,C of 3)
U4  SIM-KF016  value Sim holder  [Sim Socket]

### Ports
PWRKEY (in), RESET (in), SIM_RXD (in), SIM_TXD (out)

### Nets
3V3: C32.2 R34.1
3V8: FB1.1
GND: ANT2.2 ANT2.3 ANT2.4 ANT2.5 C27.2 C28.1 C29.1 C30.1 C31.1 C35.2 C36.2 C37.2 C38.1 C39.1 IC11.2(GND) J10.1 Q5.2(E) Q6.2(E) Q9.2(E) Q10.2(E) R40.2 R41.2 R42.2 R43.2 R48.1 R49.1 R50.2 U3.2(GND) U3.17(GND) U3.18(GND) U3.29(GND) U3.39(GND) U3.45(GND) U3.46(GND) U3.54(GND) U3.58(GND) U3.59(GND) U3.61(GND) U3.62(GND) U3.63(GND) U3.64(GND) U3.65(GND) U3.69(GND) U3.70(GND) U3.71(GND) U3.72(GND) U3.73(GND) U3.74(GND) U3.75(GND) U3.76(GND) U3.77(GND) U3.78(GND) U3.79(GND) U3.80(GND) U3.81(GND) U3.82(GND) U3.83(GND) U3.84(GND) U3.85(GND) U3.86(GND) U3.87(GND) U3.88(GND) U3.89(GND) U3.91(GND) U3.92(GND) U3.94(GND) U4.5(GND)
VBAT: C27.1 C28.2 C29.2 C30.2 C31.2 FB1.2 IC11.5(VCC) LED8.1 LED9.1 U3.55(VBAT) U3.56(VBAT) U3.57(VBAT)
VDD_1V8: C33.1 C34.1 R35.1 R36.2 R37.2 TP3.1 U3.15(VDD_1V8)
VDD_2V8: TP4.1 U3.99(VDD_2V8)
1PPS: U3.100(1PPS)
BT_ANT: U3.93(BT_ANT)
GNSS_1V8: U3.97(GNSS_1V8)
GNSS_PWRCTRL: U3.98(GNSS_PWRCTRL)
GNSS_RX: U3.96(GNSS_RXD)
GNSS_TX: U3.95(GNSS_TXD)
GPS_ANT: U3.90(GPS_ANT)
MAIN_ANT: ANT2.1 U3.60(RF_ANT)
NETLIGHT: R46.1 U3.52(NETLIGHT)
PKEY: Q5.3(C) S1.2 U3.1(PWRKEY)
RESET: Q6.3(C) S2.2 U3.16(RESET)
SIM_CLK: C37.1 IC11.4(IO3) R52.1 U3.32(SIM_CLK)
SIM_DATA: C36.1 IC11.3(IO2) R51.1 U3.31(SIM_DATA)
SIM_N: J10.2 U3.28(USB_DM)
SIM_P: J10.3 U3.27(USB_DP)
SIM_RST: C38.2 IC11.6(IO4) R53.1 U3.33(SIM_RST)
SIM_RX: Q8.3(C) R35.2 U3.10(U1_RXD)
SIM_TX: Q7.2(E) U3.9(U1_TXD)
SIM_VDD: C35.1 IC11.1(IO1) U3.30(SIM_VDD) U4.1(VCC)
STATUS: R47.1 U3.66(STATUS)
VBUS: C39.2 J10.4 U3.24(VBUS)
NetC32_1: C32.1 Q7.3(C) R34.2 ; port SIM_TXD
NetC33_2: C33.2 Q8.1(B) R37.1
NetC34_2: C34.2 Q7.1(B) R36.1
NetJ8_1: J8.1 U3.50(UART3_TXD)
NetJ8_2: J8.2 U3.49(UART3_RXD)
NetJ9_1: J9.1 R50.1
NetJ9_2: J9.2 U3.6(USB_BOOT)
NetJ11_1: J11.1 U3.23(UART_LOG_TX)
NetJ11_2: J11.2 U3.22(UART_LOG_RX)
NetLED8_2: LED8.2 R44.2
NetLED9_2: LED9.2 R45.2
NetQ5_1: Q5.1(B) R38.1 R40.1
NetQ6_1: Q6.1(B) R39.1 R42.1
NetQ8_2: Q8.2(E) ; port SIM_RXD
NetQ9_1: Q9.1(B) R46.2 R48.2
NetQ9_3: Q9.3(C) R44.1
NetQ10_1: Q10.1(B) R47.2 R49.2
NetQ10_3: Q10.3(C) R45.1
NetR38_2: R38.2 ; port PWRKEY
NetR39_2: R39.2 ; port RESET
NetR41_1: R41.1 S1.1
NetR43_1: R43.1 S2.1
NetR51_2: R51.2 U4.7(DATA)
NetR52_2: R52.2 U4.3(CLK)
NetR53_2: R53.2 U4.2(RST)

Not connected (* = marked no-connect by the designer): U3 3(U1_DTR)* 4(U1_RI)* 5(U1_DCD)* 7(U1_CTS)* 8(U1_RTS)* 11(SPI_CLK)* 12(SPI_CS)* 13(SPI_MOSI)* 14(SPI_MISO)* 19(GPIO1)* 20(MK_IN_3)* 21(MK_OUT_3)* 25(ADC)* 26(GPIO2)* 34(SIM_DET)* 35(MK_OUT_6/I2C3_SDA)* 36(MK_IN_6/I2C3_SCL)* 37(CI2C2_SDA)* 38(CI2C2_SCL)* 40(EAR_P)* 41(EAR_N)* 42(MIC_P)* 43(MIC_N)* 44(MK_OUT_2)* 47(MK_IN_2)* 48(GPIO2)* 51(VBAT_ADC)* 53(GPIO4)* 67(MK_OUT_5)* 68(MK_IN_5)* 101(LCD_BL_PWM)* 102(LCD_SPI_CLK)* 103(LCD_SPI_TXD)* 104(LCD_SPI_RXD)* 105(LCD_SPI_CS)* 106(LCD_RST)* 107(LCD_DCX)* 108(SIM2_DATA)* 109(SIM2_CLK)* 110(SIM2_VDD)* 111(SIM2_RST)* 112(SIM2_DET)* 113(NC)* 114(NC)* 115(NC)* 116(GNSS_VBKP)* 117(CAM_I2C_SDA)* 118(CAM_I2C_SCL)* 119(CAM_PWDN)* 120(CAM_RST)* 121(CAM_MCLK)* 122(CAM_SPI_D0)* 123(CAM_SPI_D1)* 124(CAM_SPI_CLK)*; U4 4(PRENSENCE)* 6(VPP)* 8(GND)*

### Layout directives
differential pair: SIM_N, SIM_P

### Notes on the sheet
- (near R38) PWRKEY
- (near R39) RESET
- LOGIC LEVEL TRANSITION
- NET STATUS
- STATUS
- GSM ANTENA
- SIM HOLDER
- Project:
- Page Contents:
- Size:
- Date:
- A3
- Checked by:
- Time:
- Revision:
- Sheet
- of
- File:

### Library data of the parts
C27 = Cap Pol: Polarized Capacitor (Axial); Published: 8-Jun-2000; LatestRevisionDate: 17-Jul-2002; LatestRevisionNote: Re-released for DXP Platform.; PackageReference: POLAR0.8; Publisher: Altium Limited
C28-C39 = CapSMD: Capacitor; Value: 33p; Published: 8-Jun-2000; LatestRevisionDate: 17-Jul-2002; LatestRevisionNote: Re-released for DXP Platform.; PackageReference: RAD-0.3; Publisher: Altium Limited
FB1 = Ferrit Bead: Generic Ferrit Bead
J8 J9 J11 = JP2: WR-PHD 2.54 mm Angled Socket Header; Manufacturer: W¨¹rth Elektronik eiSos GmbH; partNo: 613002143121; ComponentLink1 Description: Manufacturer; ComponentLink2 Description: Datasheet; NoPins: 02; Created Date: 29 March 2013; ComponentLink1URL: http://www.we-online.com; ComponentLink2URL: http://katalog.we-online.de/em/datasheet/6130xx143121.pdf; Created by: Karrer Zheng
J10 = JP4: WR-PHD 2.54 mm Angled Socket Header; Manufacturer: W¨¹rth Elektronik eiSos GmbH; partNo: 613004143121; ComponentLink1 Description: Manufacturer; ComponentLink2 Description: Datasheet; NoPins: 04; Created Date: 29 March 2013; ComponentLink1URL: http://www.we-online.com; ComponentLink2URL: http://katalog.we-online.de/em/datasheet/6130xx143121.pdf; Created by: Karrer Zheng
LED8 LED9 = LED: as LED2 on sheet MCU
Q5 Q6 Q9 Q10 = C1815: NPN 600mW, ECB; Value: C1815
Q7 Q8 = MMBT3904: NPN transitor
R34-R53 = Resistor - SMD: as R7 on sheet ESP32; Published: 08/06/2000; Publisher: Altium Hobart Technology Centre
S1 S2 = SW-SMD: Switch; Published: 24-Mar-1999; LatestRevisionDate: 17-Jul-2002; LatestRevisionNote: Re-released for DXP Platform.; PackageReference: SPST-2; Publisher: Altium Limited
TP3 TP4 = TP
U4 = Sim holder: SIM Card Holder KF-016

## Nets that join several sheets
3V3: MCU (12 pins), LoRa (C3.2 U1.3), Power (6 pins), Screen (J3.24 J3.25), ESP32 (8 pins), SIM4G (C32.2 R34.1)
3V8: Power (C19.1 L3.2 R16.2), SIM4G (FB1.1)
5V: Power (9 pins), ESP32 (D1.2), Control (8 pins)
GND: MCU (18 pins), LoRa (9 pins), Power (25 pins), Screen (J3.26 J3.27), ESP32 (31 pins), Control (12 pins), SIM4G (67 pins)
NetC32_1: MCU (U2.17), SIM4G (C32.1 Q7.3 R34.2)
NetIC1_27: MCU (U2.42), ESP32 (IC1.27)
NetIC1_28: MCU (U2.43), ESP32 (IC1.28)
NetJ3_1: MCU (U2.62), Screen (J3.1)
NetJ3_2: MCU (U2.61), Screen (J3.2)
NetJ3_3: MCU (U2.29), Screen (J3.3)
NetJ3_4: MCU (U2.30), Screen (J3.4)
NetJ3_5: MCU (U2.53), Screen (J3.5)
NetJ3_14: MCU (U2.26), Screen (J3.14)
NetJ3_15: MCU (U2.28), Screen (J3.15)
NetJ3_16: MCU (U2.27), Screen (J3.16)
NetJ3_17: MCU (U2.55), Screen (J3.17)
NetJ3_18: MCU (U2.56), Screen (J3.18)
NetJ3_19: MCU (U2.57), Screen (J3.19)
NetJ3_20: MCU (U2.58), Screen (J3.20)
NetJ3_21: MCU (U2.59), Screen (J3.21)
NetJ3_23: MCU (U2.54), Screen (J3.23)
NetJ3_29: MCU (U2.35), Screen (J3.29)
NetJ3_30: MCU (U2.36), Screen (J3.30)
NetJ3_31: MCU (U2.37), Screen (J3.31)
NetJ3_33: MCU (U2.33), Screen (J3.33)
NetJ3_34: MCU (U2.34), Screen (J3.34)
NetQ8_2: MCU (U2.16), SIM4G (Q8.2)
NetR4_2: MCU (U2.50), ESP32 (R4.2)
NetR17_2: MCU (U2.45), Power (R17.2)
NetR22_1: MCU (U2.8), Control (R22.1 R24.1)
NetR23_1: MCU (U2.9), Control (R23.1 R26.1)
NetR28_1: MCU (U2.10), Control (R28.1 R30.1)
NetR29_1: MCU (U2.11), Control (R29.1 R32.1)
NetR38_2: MCU (U2.14), SIM4G (R38.2)
NetR39_2: MCU (U2.15), SIM4G (R39.2)
NetU1_4: MCU (U2.24), LoRa (U1.4)
NetU1_5: MCU (U2.25), LoRa (U1.5)
NetU1_6: MCU (U2.38), LoRa (U1.6)
NetU1_7: MCU (U2.39), LoRa (U1.7)
NetU1_8: MCU (U2.40), LoRa (U1.8)
NetU1_10: MCU (U2.41), LoRa (U1.10)
NetU1_11: MCU (U2.44), LoRa (U1.11)
NetU1_12: MCU (U2.21), LoRa (U1.12)
NetU1_13: MCU (U2.22), LoRa (U1.13)
NetU1_14: MCU (U2.23), LoRa (U1.14)
NetU1_15: MCU (U2.20), LoRa (U1.15)